# EAGLE schematic MotorTest (EAGLE 8.3.1)
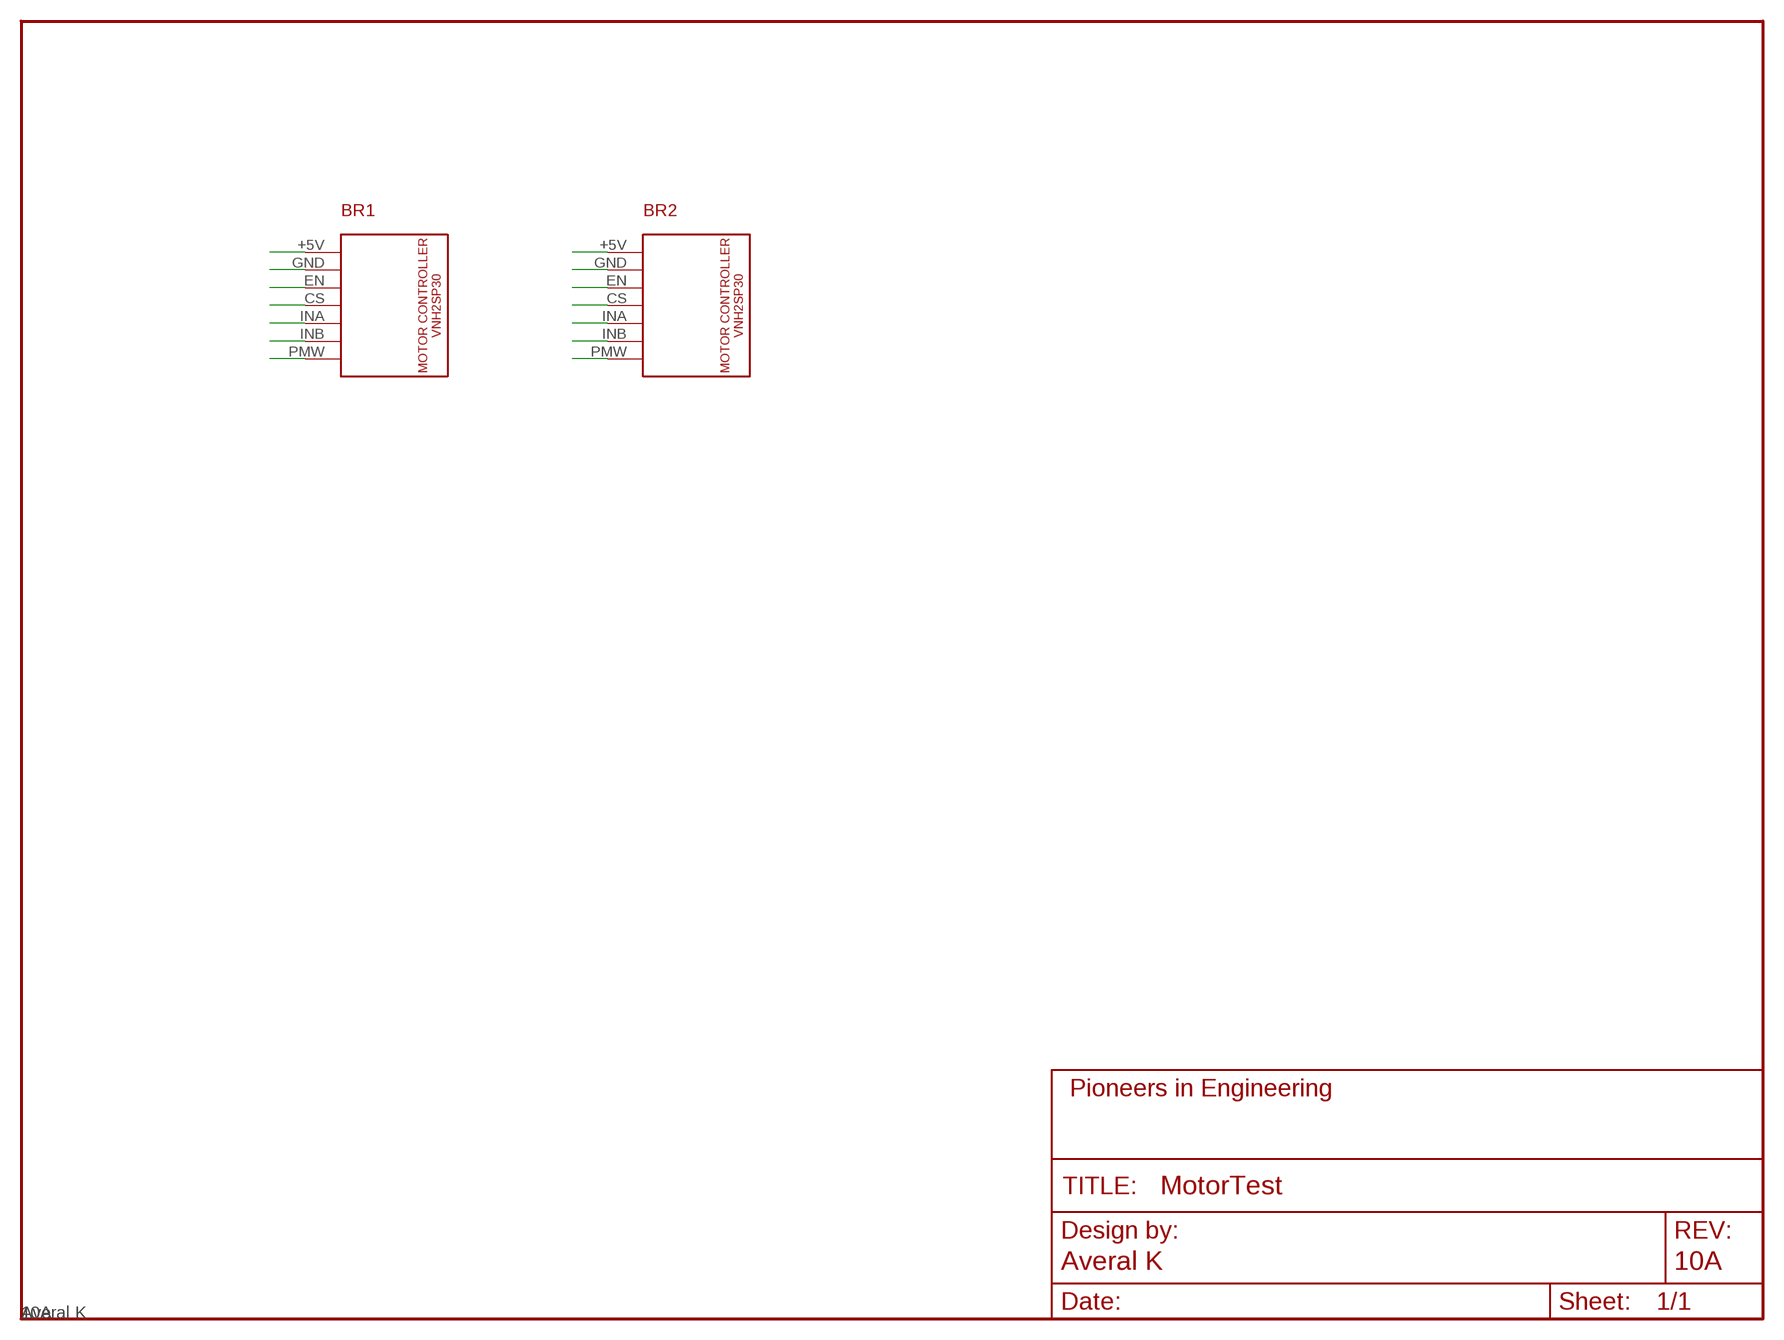
[diagram p0: schematic, sheet 1]
FRAME1 (FRAME_SCHEMATIC): AUTHOR: Averal K; REVISION: 10A

## Parts
BR1  VNH2SP30_MOTOR_CONTROLLER  [VNH2SP30_MOTOR_CONTROLLER]
BR2  VNH2SP30_MOTOR_CONTROLLER  [VNH2SP30_MOTOR_CONTROLLER]

## Nets
+5V: BR1.+5V BR2.+5V
CS: BR1.CS BR2.CS
EN: BR1.EN BR2.EN
HIGH: BR1.GND BR2.GND
INA: BR1.INA BR2.INA
INB: BR1.INB BR2.INB
PWM: BR1.PMW(PWM) BR2.PMW(PWM)

## Library data of the parts
BR1 BR2 = pie:VNH2SP30_MOTOR_CONTROLLER: VNH2SP30 MOTOR CONTROLLER